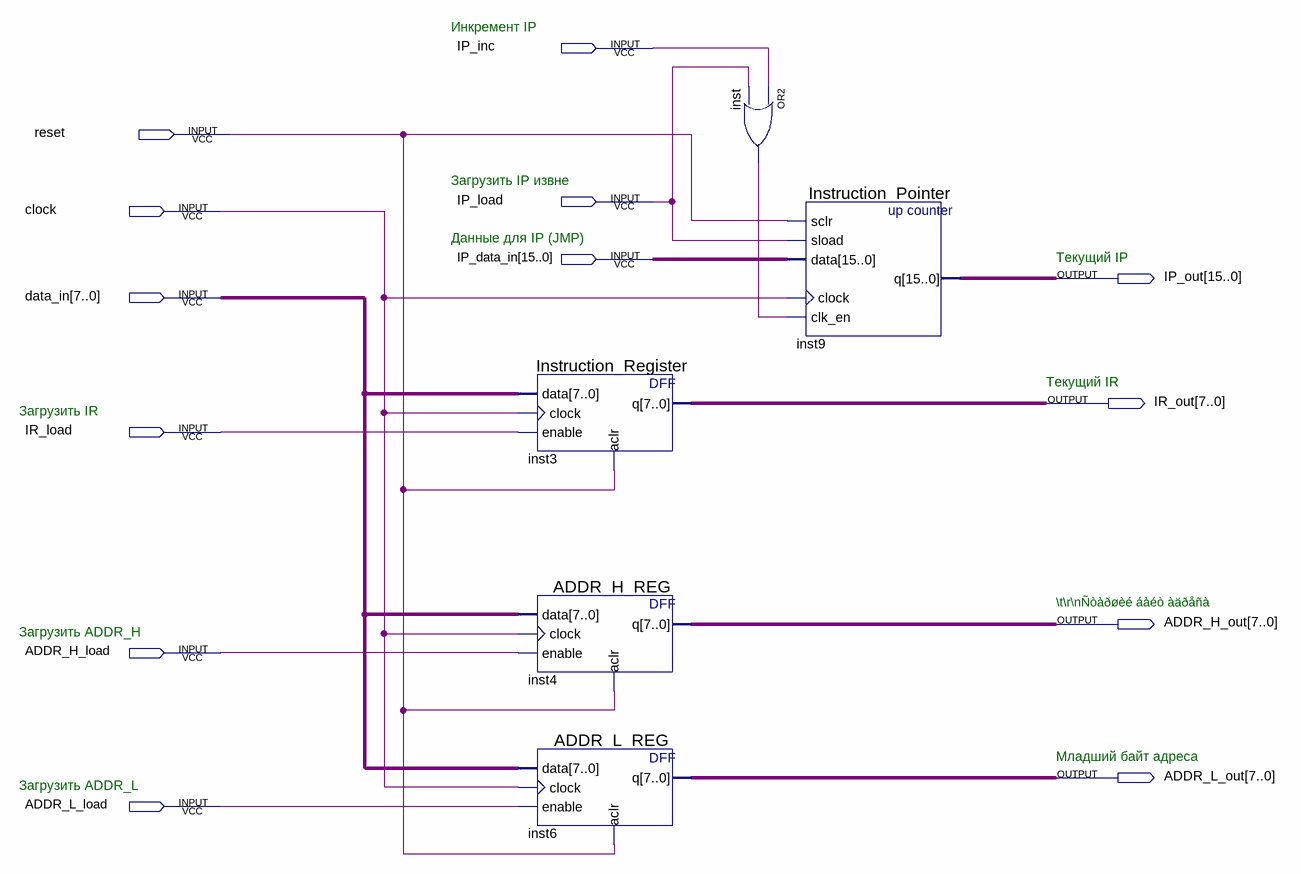
[diagram p0: schematic sheet]
// Quartus schematic special_registers.bdf as structural Verilog: 5 symbols, 13 pins
module special_registers (
  input  IP_inc,
  input  reset,
  input  IP_load,
  input  clock,
  input  [15:0] IP_data_in,
  input  [7:0] data_in,
  input  IR_load,
  input  ADDR_H_load,
  input  ADDR_L_load,
  output [15:0] IP_out,
  output [7:0] IR_out,
  output [7:0] ADDR_H_out,
  output [7:0] ADDR_L_out
);

  wire inst_out;

  Instruction_Register inst3 (.data(data_in), .clock(clock), .enable(IR_load), .aclr(reset), .q(IR_out));
  ADDR_H_REG inst4 (.data(data_in), .clock(clock), .enable(ADDR_H_load), .aclr(reset), .q(ADDR_H_out));
  ADDR_L_REG inst6 (.data(data_in), .clock(clock), .enable(ADDR_L_load), .aclr(reset), .q(ADDR_L_out));
  or inst (inst_out, IP_inc, IP_load);
  Instruction_Pointer inst9 (
    .sclr(reset), .sload(IP_load), .data(IP_data_in), .clock(clock), .clk_en(inst_out), .q(IP_out));

  // Notes on the sheet:
  //   Инкремент IP
  //   Загрузить IP извне
  //   Данные для IP (JMP)
  //   Текущий IP
  //   Текущий IR
  //   Загрузить IR
  //   \t\r\nÑòàðøèé áàéò àäðåñà
  //   Загрузить ADDR_H
  //   Младший байт адреса
  //   Загрузить ADDR_L
endmodule
